# EasyEDA schematic Pixelart.json
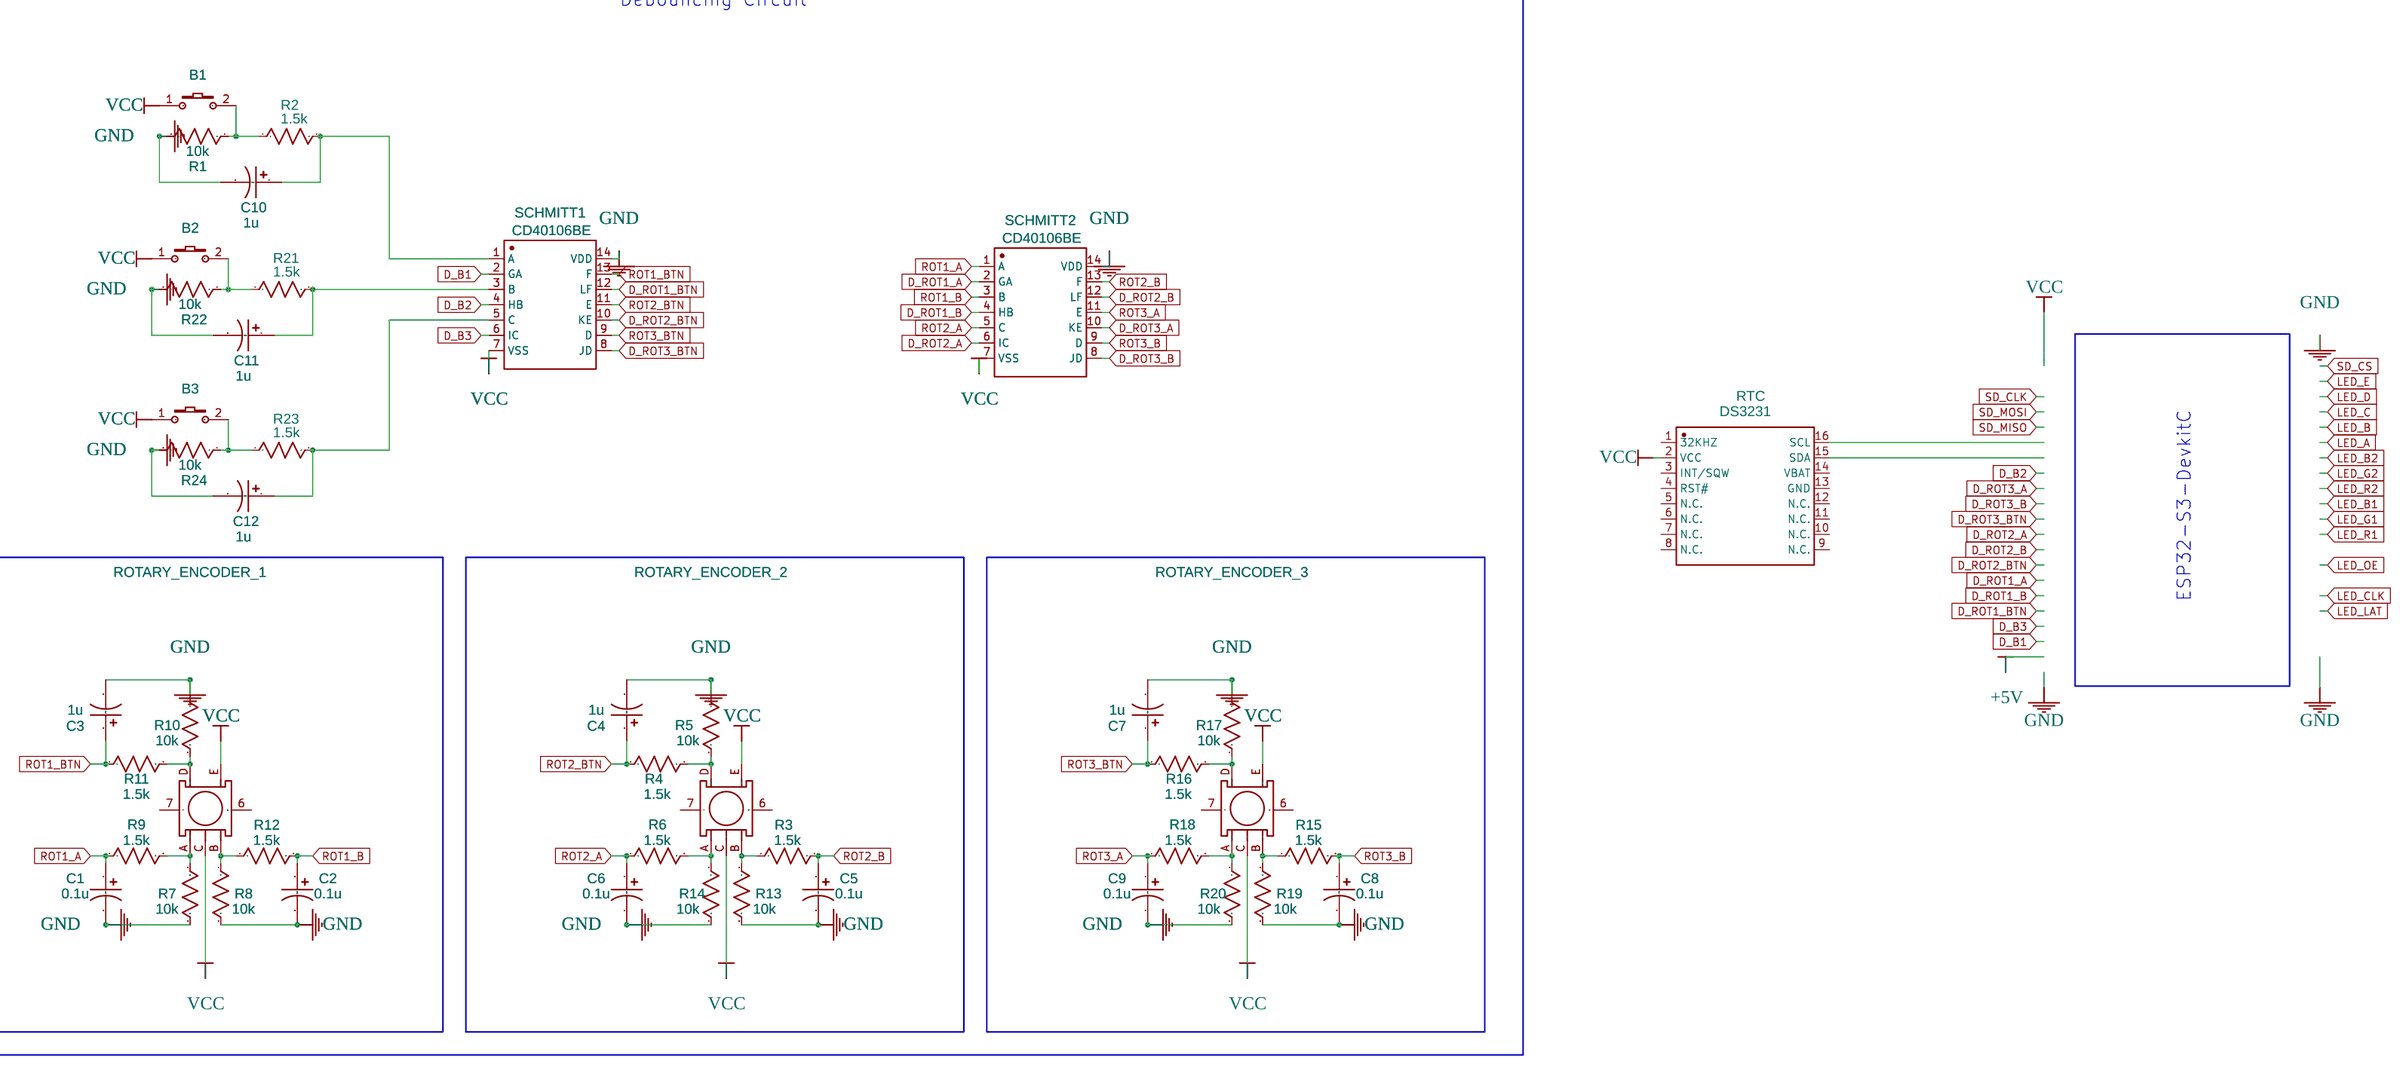
[diagram p0: schematic sheet]

## Parts
C1  0.1u  [CASE-A_3216]
C2  0.1u  [CASE-A_3216]
C3  1u  [CASE-A_3216]
C4  1u  [CASE-A_3216]
C5  0.1u  [CASE-A_3216]
C6  0.1u  [CASE-A_3216]
C7  1u  [CASE-A_3216]
C8  0.1u  [CASE-A_3216]
C9  0.1u  [CASE-A_3216]
C10  1u  [CASE-A_3216]
C11  1u  [CASE-A_3216]
C12  1u  [CASE-A_3216]
KEY1  B1  [KEY-SMD_2P-L6.2-W3.6-LS8.0]
KEY2  B2  [KEY-SMD_2P-L6.2-W3.6-LS8.0]
KEY3  B3  [KEY-SMD_2P-L6.2-W3.6-LS8.0]
R1  10k  [R0603]
R2  1.5k  [R0603]
R3  1.5k  [R0603]
R4  1.5k  [R0603]
R5  10k  [R0603]
R6  1.5k  [R0603]
R7  10k  [R0603]
R8  10k  [R0603]
R9  1.5k  [R0603]
R10  10k  [R0603]
R11  1.5k  [R0603]
R12  1.5k  [R0603]
R13  10k  [R0603]
R14  10k  [R0603]
R15  1.5k  [R0603]
R16  1.5k  [R0603]
R17  10k  [R0603]
R18  1.5k  [R0603]
R19  10k  [R0603]
R20  10k  [R0603]
R21  1.5k  [R0603]
R22  10k  [R0603]
R23  1.5k  [R0603]
R24  10k  [R0603]
ROTARY_ENCODER_1  EC11E15244B2  [SW-TH_EC11XXXXXXXX]
ROTARY_ENCODER_2  EC11E15244B2  [SW-TH_EC11XXXXXXXX]
ROTARY_ENCODER_3  EC11E15244B2  [SW-TH_EC11XXXXXXXX]
RTC  DS3231  [SO-16_L10.3-W7.5-P1.27-LS10.3-BL]
SCHMITT1  CD40106BE  [DIP-14_L19.2-W6.6-P2.54-LS10.9-BL]
SCHMITT2  CD40106BE  [DIP-14_L19.2-W6.6-P2.54-LS10.9-BL]

## Library data of the parts
C1-C12 = C_Tan_SMD_A_US: Contributor: LCEDA_Lib
KEY1-KEY3 = K2-3.6×6.1_SMD: Supplier Part: C118141; Supplier: LCSC; Manufacturer Part: K2-1107ST-A4SW-06; Contributor: LCEDA_Lib; 制造商: 韩国韩荣
R1-R24 = R_0603_US: Contributor: LCEDA_Lib
ROTARY_ENCODER_1-ROTARY_ENCODER_3 = EC11E15244B2: Supplier: LCSC; Supplier Part: C470754; Manufacturer: ALPSALPINE(阿尔卑斯阿尔派); Contributor: LCSC; JLCPCB Part Class: Extended Part
RTC = DS3231N: Supplier: LCSC; Supplier Part: C9900010264; Manufacturer: null; JLCPCB Part Class: Extended Part; Contributor: LCSC
SCHMITT1 SCHMITT2 = CD40106BE: Supplier: LCSC; Manufacturer: TI(德州仪器); Supplier Part: C71251; JLCPCB Part Class: Extended Part

## Nets
GND: C1.2 C2.2 C3.2 C4.2 C5.2 C6.2 C7.2 C8.2 C9.2 C10.2 C11.2 C12.2 R1.2 R5.1 R7.2 R8.2 R10.1 R13.2 R14.2 R17.1 R19.2 R20.2 R22.2 R24.2 SCHMITT1.14(VDD) SCHMITT2.14(VDD)
VCC: KEY1.1 KEY2.1 KEY3.1 ROTARY_ENCODER_1.C ROTARY_ENCODER_1.E ROTARY_ENCODER_2.C ROTARY_ENCODER_2.E ROTARY_ENCODER_3.C ROTARY_ENCODER_3.E RTC.2(VCC) SCHMITT1.7(VSS) SCHMITT2.7(VSS)
D_B1: SCHMITT1.2(GA)
D_B2: SCHMITT1.4(HB)
D_B3: SCHMITT1.6(IC)
D_ROT1_A: SCHMITT2.2(GA)
D_ROT1_B: SCHMITT2.4(HB)
D_ROT1_BTN: SCHMITT1.12(LF)
D_ROT2_A: SCHMITT2.6(IC)
D_ROT2_B: SCHMITT2.12(LF)
D_ROT2_BTN: SCHMITT1.10(KE)
D_ROT3_A: SCHMITT2.10(KE)
D_ROT3_B: SCHMITT2.8(JD)
D_ROT3_BTN: SCHMITT1.8(JD)
ROT1_A: C1.1 R9.1 SCHMITT2.1(A)
ROT1_B: C2.1 R12.2 SCHMITT2.3(B)
ROT1_BTN: C3.1 R11.1 SCHMITT1.13(F)
ROT2_A: C6.1 R6.1 SCHMITT2.5(C)
ROT2_B: C5.1 R3.2 SCHMITT2.13(F)
ROT2_BTN: C4.1 R4.1 SCHMITT1.11(E)
ROT3_A: C9.1 R18.1 SCHMITT2.11(E)
ROT3_B: C8.1 R15.2 SCHMITT2.9(D)
ROT3_BTN: C7.1 R16.1 SCHMITT1.9(D)
Net-(C10-1): C10.1 R2.2 SCHMITT1.1(A)
Net-(C11-1): C11.1 R21.2 SCHMITT1.3(B)
Net-(C12-1): C12.1 R23.2 SCHMITT1.5(C)
Net-(KEY1-2): KEY1.2 R1.1 R2.1
Net-(KEY2-2): KEY2.2 R21.1 R22.1
Net-(KEY3-2): KEY3.2 R23.1 R24.1
Net-(R3-1): R3.1 R13.1 ROTARY_ENCODER_2.B
Net-(R4-2): R4.2 R5.2 ROTARY_ENCODER_2.D
Net-(R6-2): R6.2 R14.1 ROTARY_ENCODER_2.A
Net-(R7-1): R7.1 R9.2 ROTARY_ENCODER_1.A
Net-(R8-1): R8.1 R12.1 ROTARY_ENCODER_1.B
Net-(R10-2): R10.2 R11.2 ROTARY_ENCODER_1.D
Net-(R15-1): R15.1 R19.1 ROTARY_ENCODER_3.B
Net-(R16-2): R16.2 R17.2 ROTARY_ENCODER_3.D
Net-(R18-2): R18.2 R20.1 ROTARY_ENCODER_3.A

Not connected (* = marked no-connect by the designer): ROTARY_ENCODER_1 6 7; ROTARY_ENCODER_2 6 7; ROTARY_ENCODER_3 6 7; RTC 1(32KHZ) 3(INT/SQW) 4(RST#) 5(N.C.) 6(N.C.) 7(N.C.) 8(N.C.) 9(N.C.) 10(N.C.) 11(N.C.) 12(N.C.) 13(GND) 14(VBAT) 15(SDA) 16(SCL)

## Notes on the sheet
- Debouncing Circuit
- ESP32-S3-DevkitC
